# EAGLE design micro (EAGLE 7.7.0)
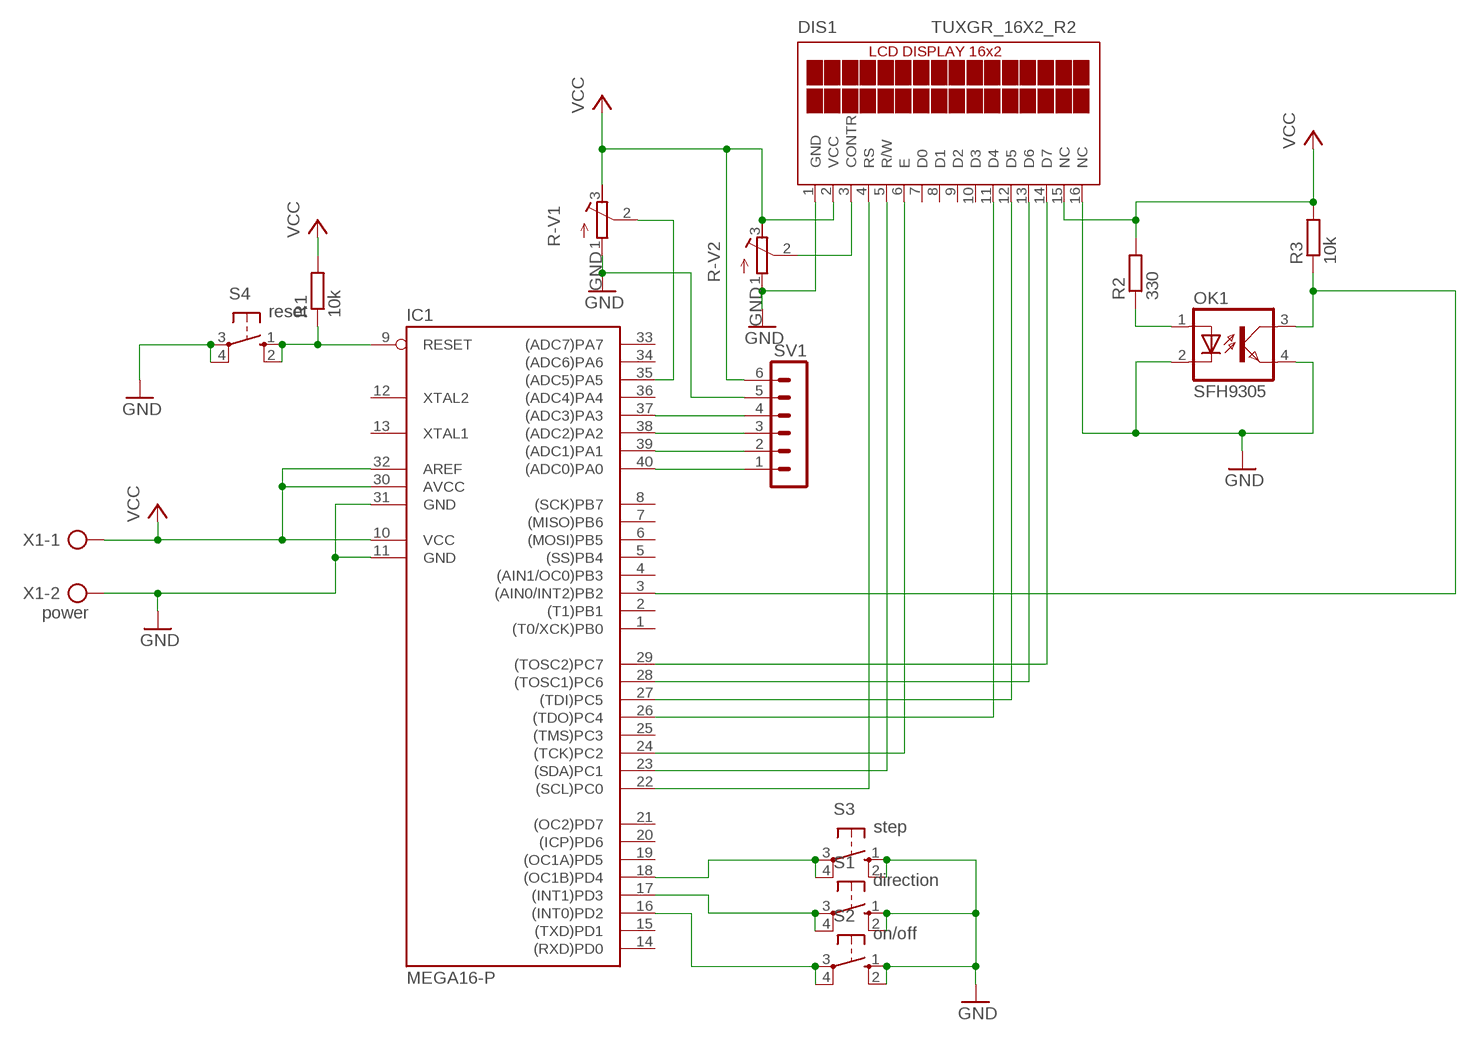
[diagram p0: schematic, sheet 1]

## Parts
DIS1  TUXGR_16X2_R2  [TUXGR_16X2_R2]
IC1  MEGA16-P  [DIL40]
OK1  SFH9305  [SFH9305]
R1  10k  R-EU_0204/5  [0204/5]
R2  330  R-EU_0204/5  [0204/5]
R3  10k  R-EU_0204/5  [0204/5]
R-V1  R-V  [R-V]
R-V2  R-V  [R-V]
S1  direction  10-XX  [B3F-10XX]
S2  on/off  10-XX  [B3F-10XX]
S3  step  10-XX  [B3F-10XX]
S4  reset  10-XX  [B3F-10XX]
SV1  MA06-1  [MA06-1]
X1  power  AK300/2  [AK300/2]

## Nets
GND: DIS1.1(GND) DIS1.16(NC) IC1.11(GND) IC1.31(GND) OK1.2(C) OK1.4(EMIT) R-V1.1(A) R-V2.1(A) S1.1(S) S1.2(S1) S2.1(S) S2.2(S1) S3.1(S) S3.2(S1) S4.3(P) S4.4(P1) SV1.5 X1.2
N$1: DIS1.14(D7) IC1.29((TOSC2)PC7)
N$2: DIS1.13(D6) IC1.28((TOSC1)PC6)
N$3: DIS1.12(D5) IC1.27((TDI)PC5)
N$4: DIS1.11(D4) IC1.26((TDO)PC4)
N$5: DIS1.6(E) IC1.24((TCK)PC2)
N$6: DIS1.4(RS) IC1.22((SCL)PC0)
N$7: DIS1.3(CONTR) R-V2.2(S)
N$8: IC1.3((AIN0/INT2)PB2) OK1.3(COL) R3.1
N$9: IC1.35((ADC5)PA5) R-V1.2(S)
N$10: DIS1.5(R/W) IC1.23((SDA)PC1)
N$11: IC1.40((ADC0)PA0) SV1.1
N$12: IC1.39((ADC1)PA1) SV1.2
N$13: IC1.38((ADC2)PA2) SV1.3
N$14: IC1.17((INT1)PD3) S1.3(P) S1.4(P1)
N$15: IC1.37((ADC3)PA3) SV1.4
N$16: IC1.16((INT0)PD2) S2.3(P) S2.4(P1)
N$17: IC1.18((OC1B)PD4) S3.3(P) S3.4(P1)
N$23: OK1.1(A) R2.1
N$24: IC1.9(RESET) R1.1 S4.1(S) S4.2(S1)
VCC: DIS1.2(VCC) DIS1.15(NC) IC1.10(VCC) IC1.30(AVCC) IC1.32(AREF) R1.2 R2.2 R3.2 R-V1.3(E) R-V2.3(E) SV1.6 X1.1
Unconnected: DIS1.7(D0) DIS1.8(D1) DIS1.9(D2) DIS1.10(D3) IC1.1((T0/XCK)PB0) IC1.2((T1)PB1) IC1.4((AIN1/OC0)PB3) IC1.5((SS)PB4) IC1.6((MOSI)PB5) IC1.7((MISO)PB6) IC1.8((SCK)PB7) IC1.12(XTAL2) IC1.13(XTAL1) IC1.14((RXD)PD0) IC1.15((TXD)PD1) IC1.19((OC1A)PD5) IC1.20((ICP)PD6) IC1.21((OC2)PD7) IC1.25((TMS)PC3) IC1.33((ADC7)PA7) IC1.34((ADC6)PA6) IC1.36((ADC4)PA4)

## Library data of the parts
DIS1 = display-lcd:TUXGR_16X2_R2: Tuxgraphics LCD display 16x2 characters reflective, without background light Source: tuxgr_12x2_r2.pdf; OC_FARNELL: unknown; OC_NEWARK: unknown
IC1 = atmel:MEGA16-P: MICROCONTROLLER 16 Kbytes FLASH 1 kbytes SRAM 512 bytes EEPROM USART 8-channel 10 bit ADC Source: avr.lbr; MPN: ATMEGA16-16PU; OC_FARNELL: 9171142; OC_NEWARK: 01M6885
OK1 = optocoupler:SFH9*: Slotted Interrupter / Gabellichtschranke Source: http://www.osram.convergy.de/; OC_FARNELL: unknown; OC_NEWARK: unknown
R1-R3 = Mohammad Waleed:R-EU_: RESISTOR, European symbol
R-V1 R-V2 = Mohammad Waleed:R-V
S1-S4 = Mohammad Waleed:10-XX: OMRON SWITCH; MPN: B3F-1000; OC_FARNELL: 176432; OC_NEWARK: 36M3542
SV1 = con-lstb:MA06-1: PIN HEADER; OC_FARNELL: unknown; OC_NEWARK: unknown
X1 = Mohammad Waleed:AK300/2: CONNECTOR; OC_FARNELL: unknown; OC_NEWARK: unknown

## Board
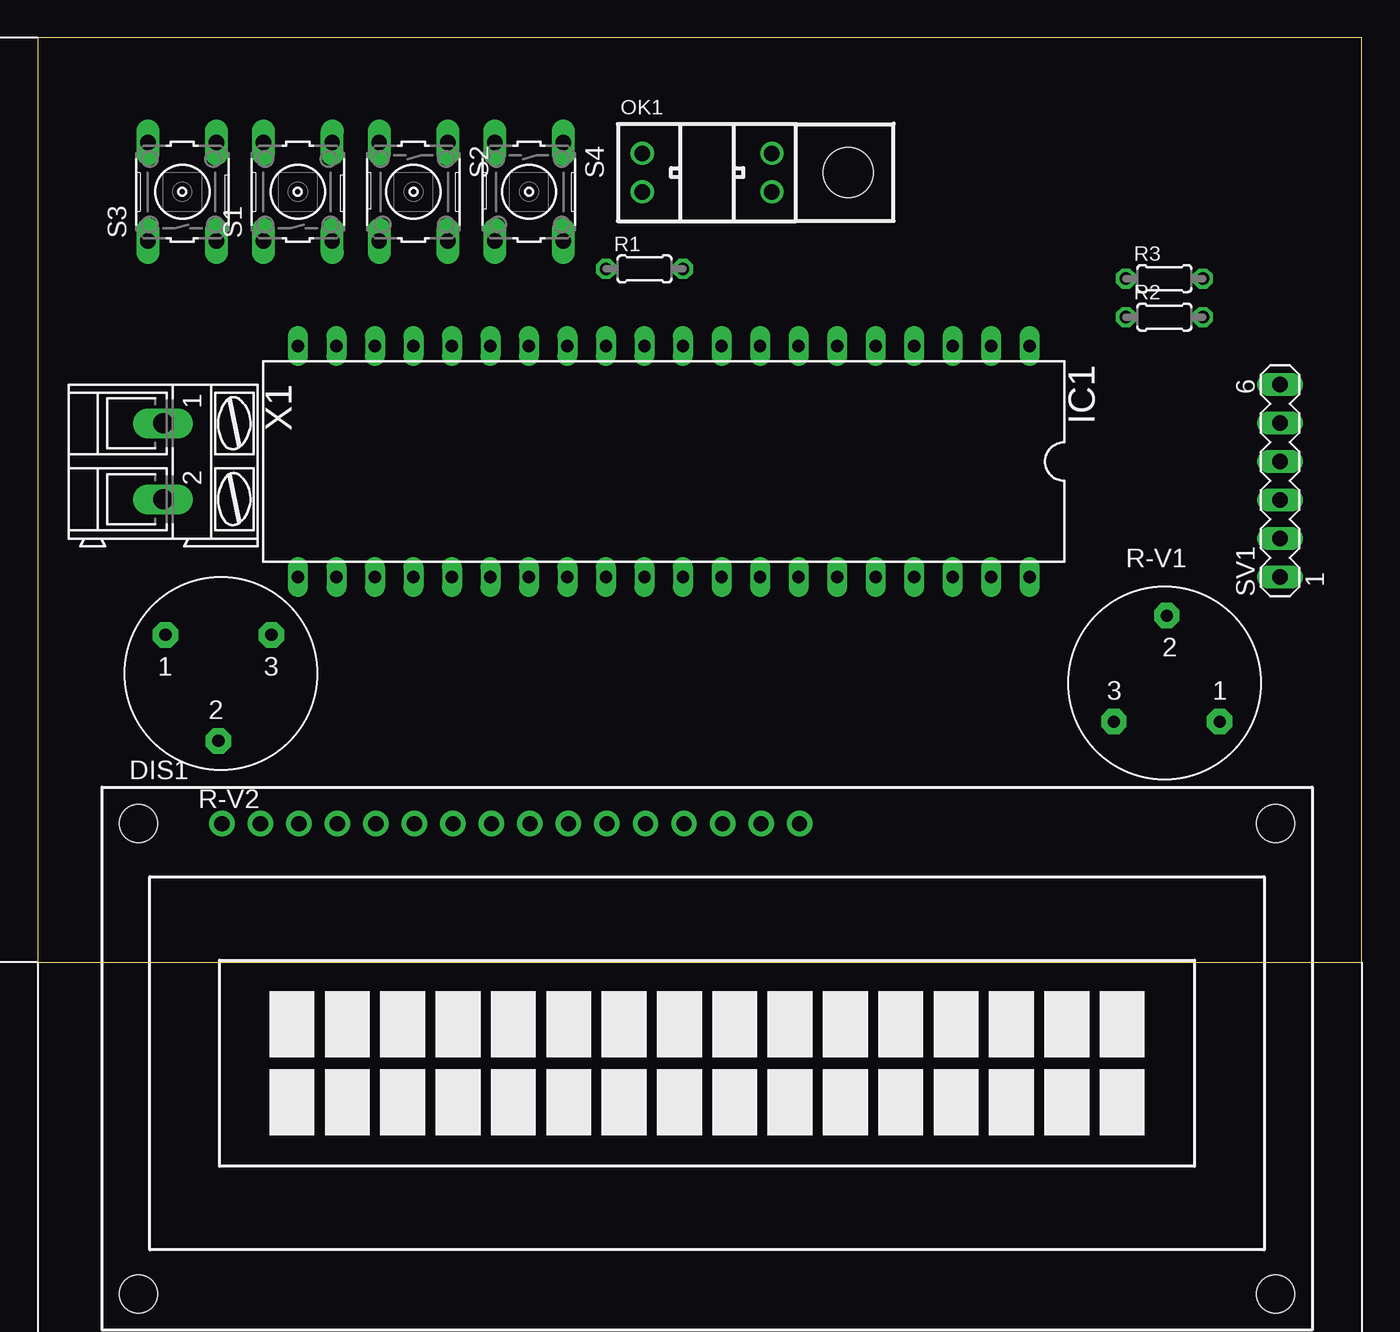
[diagram p1: board, top side]
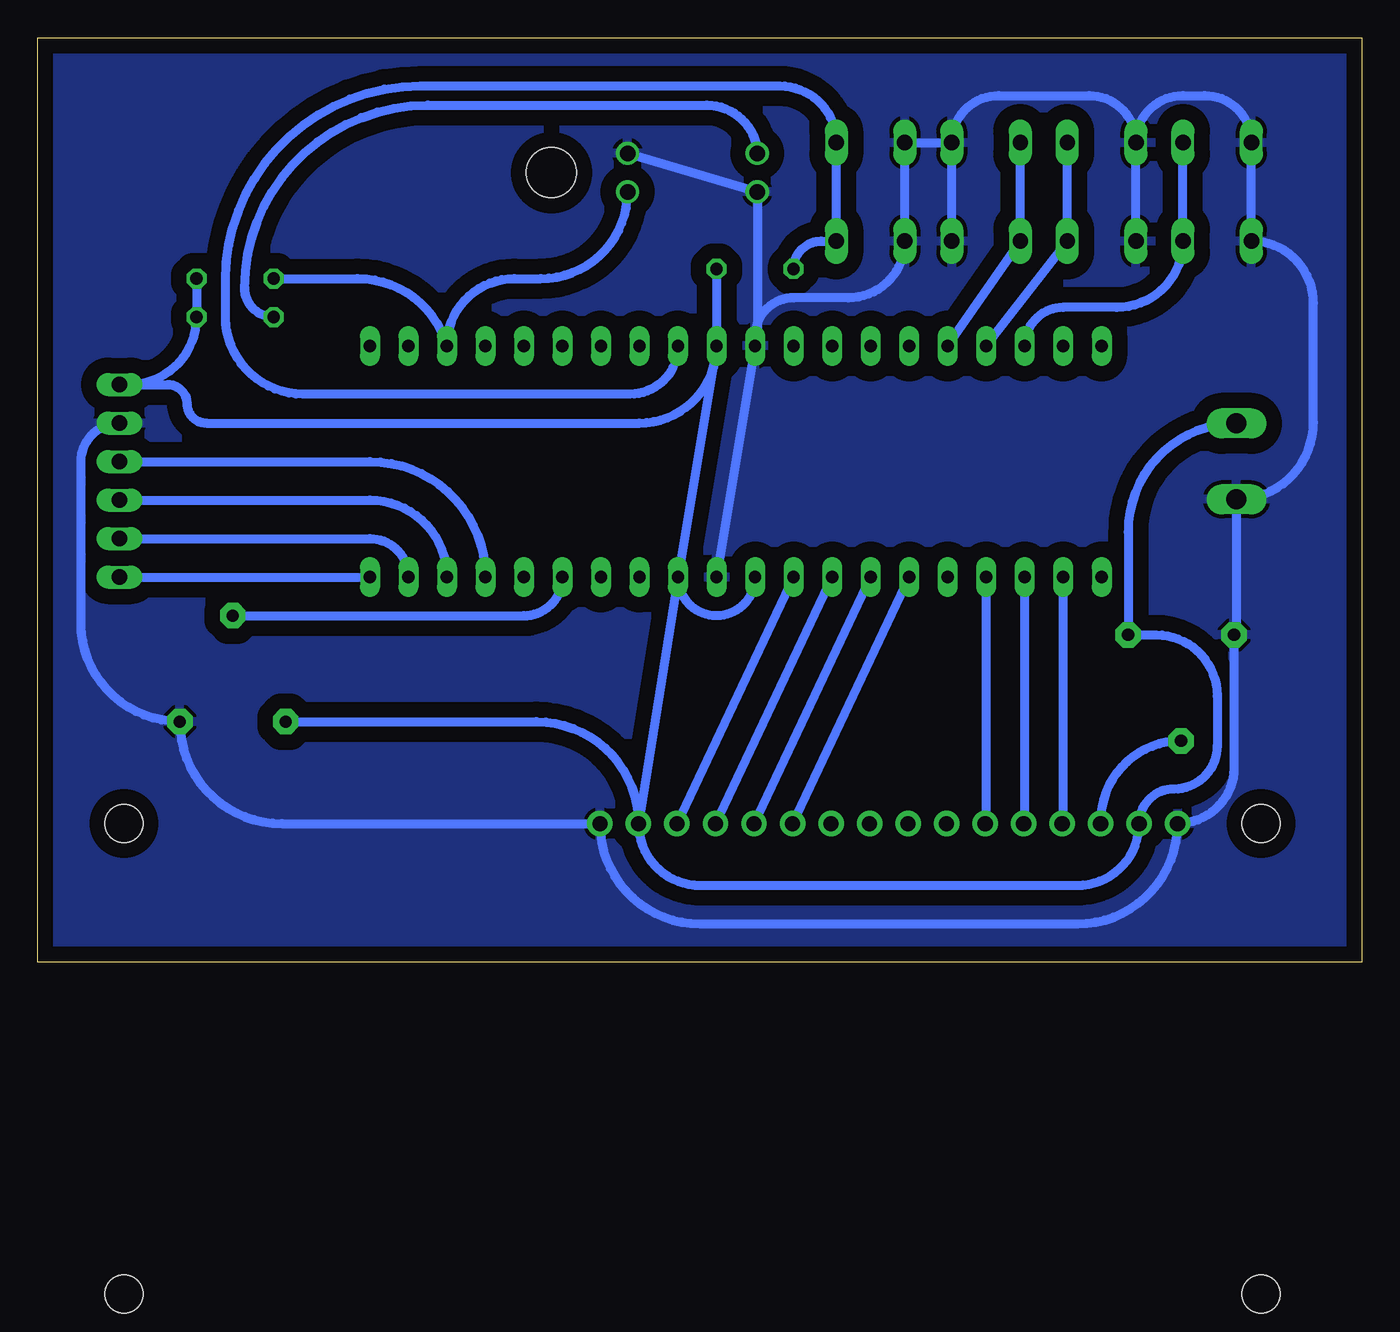
[diagram p2: board, bottom side, seen from below]

Size 87.3 x 60.95 mm. Coordinates in mm from the lower left corner, seen from the top.
Outline: 0,0 87.3,0 87.3,60.95 0,60.95 0,0
Copper layers (1*16): Top 0.035mm / dielectric 1.5mm / Bottom 0.035mm
Design rules "mws!": minimum track width 16mil, minimum drill 23mil, track to track 16mil, track to pad 16mil, pad to pad 16mil, via to via 16mil, smd to smd 8mil, copper to edge 40mil, drill to drill 8mil, minimum pad ring 10mil, minimum via ring 8mil, stop-mask expansion 4mil, vias tented up to drill 0mil, thermal gap 10mil

### Footprints (pad centres in the part's own frame; a part is rotated, then mirrored left to right if it is on the bottom)
TUXGR_16X2_R2 = drill 1 pad 1.676: 1 -32,15.5; 2 -29.46,15.5; 3 -26.92,15.5; 4 -24.38,15.5; 5 -21.84,15.5; 6 -19.3,15.5; 7 -16.76,15.5; 8 -14.22,15.5; 9 -11.68,15.5; 10 -9.14,15.5; 11 -6.6,15.5; 12 -4.06,15.5; 13 -1.52,15.5; 14 1.02,15.5; 15 3.56,15.5; 16 6.1,15.5 | hole 2.5: -37.5,-15.5; 37.5,-15.5; -37.5,15.5; 37.5,15.5
DIL40 = drill 0.813 long: 1 -24.13,-7.62; 2 -21.59,-7.62; 3 -19.05,-7.62; 4 -16.51,-7.62; 5 -13.97,-7.62; 6 -11.43,-7.62; 7 -8.89,-7.62; 8 -6.35,-7.62; 9 -3.81,-7.62; 10 -1.27,-7.62; 11 1.27,-7.62; 12 3.81,-7.62; 13 6.35,-7.62; 14 8.89,-7.62; 15 11.43,-7.62; 16 13.97,-7.62; 17 16.51,-7.62; 18 19.05,-7.62; 19 21.59,-7.62; 20 24.13,-7.62; 21 24.13,7.62; 22 21.59,7.62; 23 19.05,7.62; 24 16.51,7.62; 25 13.97,7.62; 26 11.43,7.62; 27 8.89,7.62; 28 6.35,7.62; 29 3.81,7.62; 30 1.27,7.62; 31 -1.27,7.62; 32 -3.81,7.62; 33 -6.35,7.62; 34 -8.89,7.62; 35 -11.43,7.62; 36 -13.97,7.62; 37 -16.51,7.62; 38 -19.05,7.62; 39 -21.59,7.62; 40 -24.13,7.62
SFH9305 = drill 1.016: 1 -4.275,1.27; 2 -4.275,-1.27; 3 4.275,-1.27; 4 4.275,1.27 | hole 3.3: 9.3,0
0204/5 = drill 0.813 octagon: 1 -2.54,0; 2 2.54,0
R-V = drill 0.8 pad 1.676 octagon: 1 10.001,-3.81; 2 6.509,3.175; 3 3.016,-3.81
B3F-10XX = drill 1.016 long: 1 -3.251,2.261; 2 3.251,2.261; 3 -3.251,-2.261; 4 3.251,-2.261
MA06-1 = drill 1.016 long: 1 -6.35,0; 2 -3.81,0; 3 -1.27,0; 4 1.27,0; 5 3.81,0; 6 6.35,0
AK300/2 = drill 1.321 long: 1 -2.515,0; 2 2.489,0

### Placement (x,y rotation side)
DIS1  44.13,-6.35 0 top
IC1  41.27,33.02 180 top
OK1  44.13,52.07 0 top
R1  40.01,45.72 0 top
R2  74.3,42.55 0 top
R3  74.3,45.09 0 top
R-V1  67.94,19.68 0 top
R-V2  18.41,17.78 180 top
S1  17.14,50.8 90 top
S2  24.77,50.8 270 top
S3  9.53,50.8 90 top
S4  32.38,50.8 270 top
SV1  81.92,31.75 90 top
X1  8.26,33.02 270 top

### Tracks (layer width: path | path; a pad name or v marks a point on that pad's centre or on a via)
GND
  Bottom 0.61: S1.1 S1.2 | S2.2 S2.1 | S2.1 S4.3 S4.4 arc90 33.86,43.81 37.47,43.81 arc-90 40.01,41.27 IC1.11 | S1.2 arc90 11.79,57.15 10.36,57.15 arc90 S3.2 S3.1 arc90 3.17,43.46 3.17,35.61 arc90 X1.2 8.26,21.59 R-V2.1 8.41,12.87 arc90 DIS1.1 arc90 18.74,2.54 43.62,2.54 arc90 DIS1.16 71.22,9.15 arc90 R-V1.1 arc90 84.45,22.38 84.45,33.02 arc90 SV1.5 | IC1.11 39.86,40.64 OK1.2 OK1.4 | IC1.11 IC1.31 | S2.1 arc90 23.93,57.15 17.98,57.15 arc90 S1.2
  pour Bottom (isolate 1.016): -8.26,68.58 95.89,68.58 95.89,-31.75 -8.26,-31.75
N$1
  Bottom 0.61: IC1.29 DIS1.14
N$2
  Bottom 0.61: IC1.28 DIS1.13
N$3
  Bottom 0.61: IC1.27 DIS1.12
N$4
  Bottom 0.61: IC1.26 DIS1.11
N$5
  Bottom 0.61: IC1.24 24.77,9.15 DIS1.6
N$6
  Bottom 0.61: IC1.22 19.68,9.15 DIS1.4
N$7
  Bottom 0.61: R-V2.2 arc-90 17.21,9.3 DIS1.3
N$8
  Bottom 0.61: R3.1 66.22,45.09 arc74 IC1.3 arc90 55.88,45.09 54.12,45.09 arc-90 OK1.3
N$9
  Bottom 0.61: R-V1.2 55.24,22.86 arc-90 IC1.35
N$10
  Bottom 0.61: IC1.23 22.23,9.15 DIS1.5
N$11
  Bottom 0.61: SV1.1 IC1.40
N$12
  Bottom 0.61: SV1.2 65.41,27.94 arc90 IC1.39
N$13
  Bottom 0.61: SV1.3 65.41,30.48 arc90 IC1.38
N$14
  Bottom 0.61: S1.4 S1.3 IC1.17
N$15
  Bottom 0.61: SV1.4 65.41,33.02 arc90 IC1.37
N$16
  Bottom 0.61: S2.3 S2.4 IC1.16
N$17
  Bottom 0.61: S3.4 S3.3 arc90 16.15,43.18 19.68,43.18 arc-90 IC1.18
N$23
  Bottom 0.61: OK1.1 arc-87 43.18,56.52 61.59,56.52 arc-90 73.66,44.45 arc-90 R2.1
N$24
  Bottom 0.61: R1.1 arc90 35.64,47.55 S4.2 S4.1 arc-90 38.38,57.78 62.07,57.78 arc-90 74.93,44.93 74.93,42.59 arc-90 69.81,37.47 48.26,37.47 arc-90 IC1.9
VCC
  Bottom 0.61: DIS1.15 arc-90 43.62,5.08 18.74,5.08 arc-90 DIS1.2 arc90 12.39,11.43 12.37,11.43 arc-90 9.53,14.27 9.53,17.57 arc-90 13.54,21.59 R-V2.3 15.4,28.39 arc90 X1.1 | IC1.32 DIS1.15 | IC1.30 arc90 42.55,22.86 arc90 IC1.32 | R1.2 IC1.10 | R3.2 R2.2 arc90 81.28,38.1 | IC1.10 IC1.32 | R-V1.3 54.42,15.88 arc90 DIS1.15 | SV1.6 81.28,38.1 | 81.28,38.1 78.74,38.1 arc90 77.47,36.83 arc-90 76.2,35.56 47.62,35.56 arc-90 IC1.10